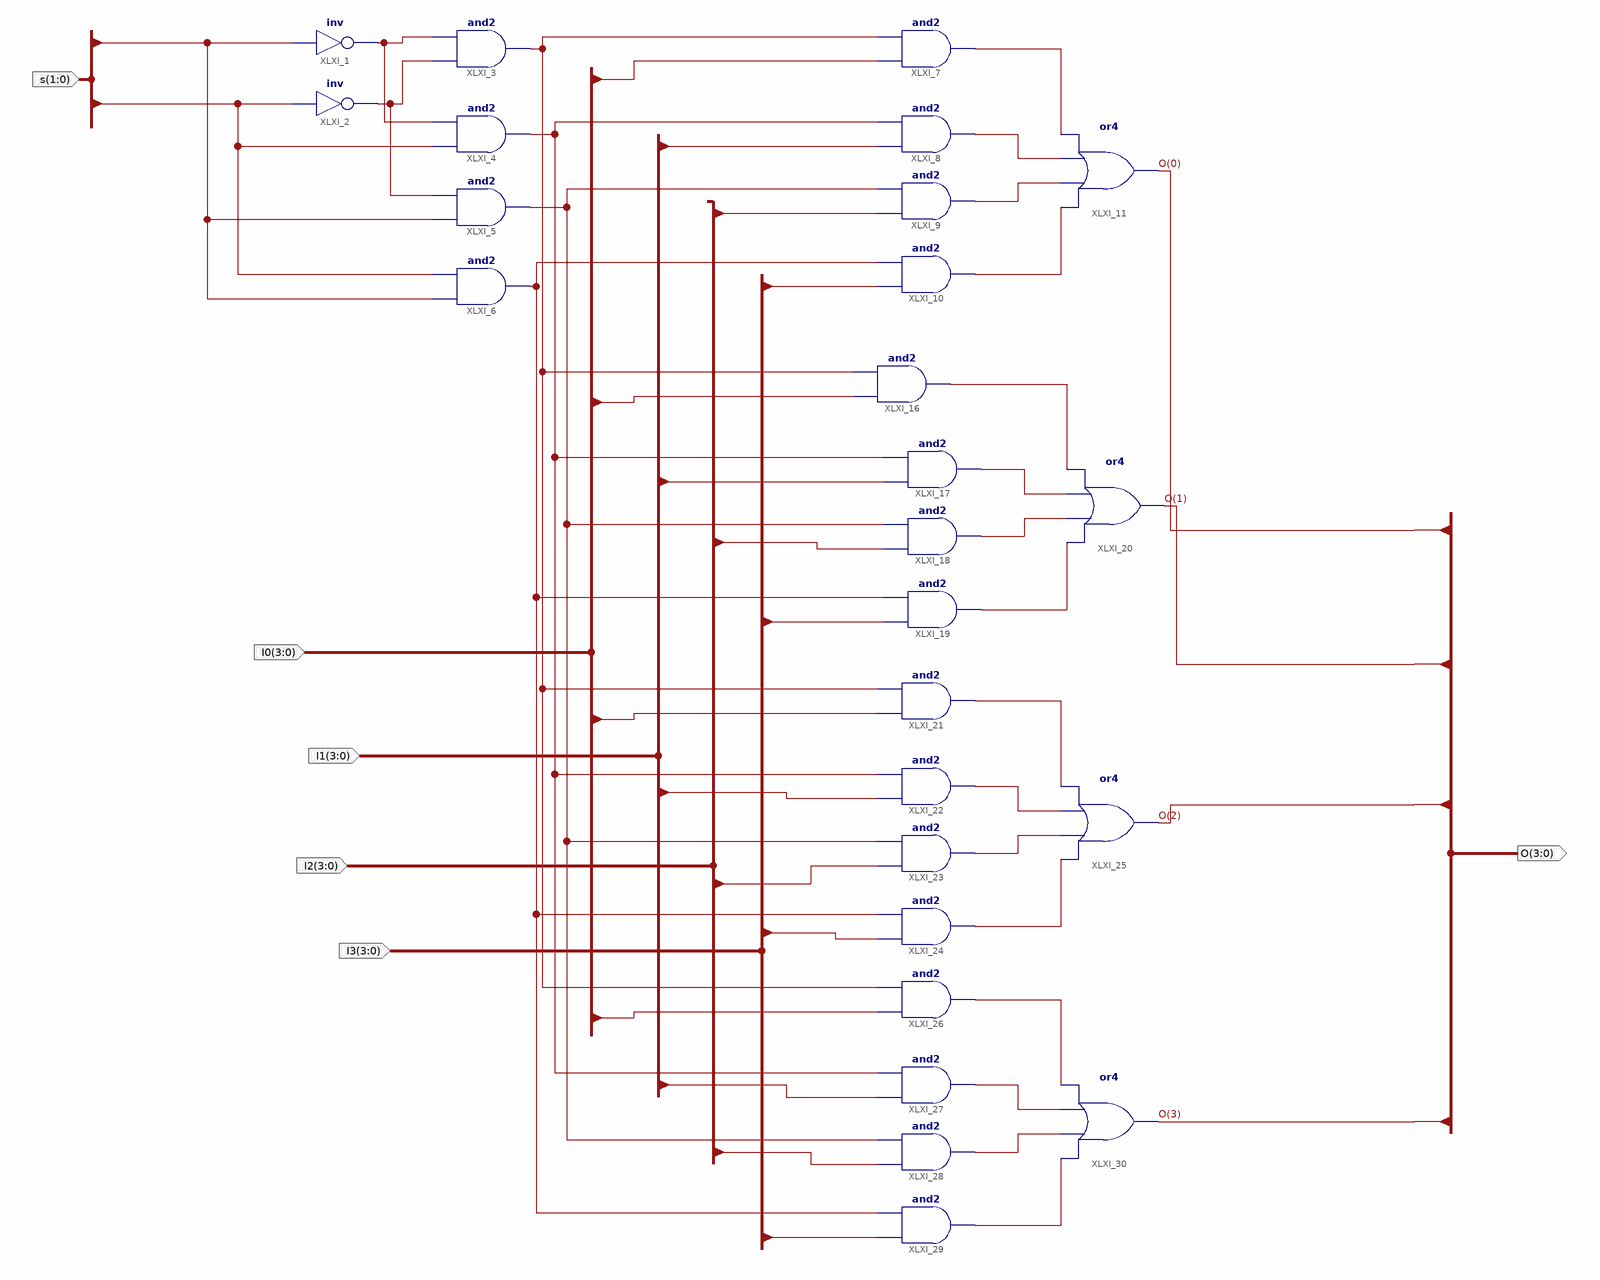
[diagram p0: schematic sheet 1]
// Xilinx ISE schematic MUX441.sch (spartan3) as structural Verilog: 26 symbols, 6 ports
module MUX441 (
  input  [1:0] s,
  input  [3:0] I0,
  input  [3:0] I1,
  input  [3:0] I2,
  input  [3:0] I3,
  output [3:0] O
);

  wire XLXN_10, XLXN_11, XLXN_21, XLXN_22, XLXN_23, XLXN_24, XLXN_27, XLXN_28, XLXN_30, XLXN_31, XLXN_32,
       XLXN_33, XLXN_35, XLXN_36, XLXN_37, XLXN_38, XLXN_40, XLXN_41, XLXN_42, XLXN_45, XLXN_48, XLXN_51;

  not XLXI_1 (XLXN_10, s[1]);
  not XLXI_2 (XLXN_11, s[0]);
  and XLXI_3 (XLXN_42, XLXN_11, XLXN_10);
  and XLXI_4 (XLXN_45, s[0], XLXN_10);
  and XLXI_5 (XLXN_48, s[1], XLXN_11);
  and XLXI_6 (XLXN_51, s[1], s[0]);
  or XLXI_20 (O[1], XLXN_28, XLXN_27, XLXN_30, XLXN_31);
  or XLXI_30 (O[3], XLXN_38, XLXN_37, XLXN_40, XLXN_41);
  and XLXI_29 (XLXN_38, I3[3], XLXN_51);
  and XLXI_28 (XLXN_37, I2[3], XLXN_48);
  and XLXI_27 (XLXN_40, I1[3], XLXN_45);
  and XLXI_26 (XLXN_41, I0[3], XLXN_42);
  or XLXI_25 (O[2], XLXN_33, XLXN_32, XLXN_35, XLXN_36);
  and XLXI_24 (XLXN_33, I3[2], XLXN_51);
  and XLXI_23 (XLXN_32, I2[2], XLXN_48);
  and XLXI_22 (XLXN_35, I1[2], XLXN_45);
  and XLXI_21 (XLXN_36, I0[2], XLXN_42);
  and XLXI_19 (XLXN_28, I3[1], XLXN_51);
  and XLXI_18 (XLXN_27, I2[1], XLXN_48);
  and XLXI_17 (XLXN_30, I1[1], XLXN_45);
  and XLXI_16 (XLXN_31, I0[1], XLXN_42);
  or XLXI_11 (O[0], XLXN_24, XLXN_23, XLXN_22, XLXN_21);
  and XLXI_10 (XLXN_24, I3[0], XLXN_51);
  and XLXI_9 (XLXN_23, I2[0], XLXN_48);
  and XLXI_8 (XLXN_22, I1[0], XLXN_45);
  and XLXI_7 (XLXN_21, I0[0], XLXN_42);
endmodule
